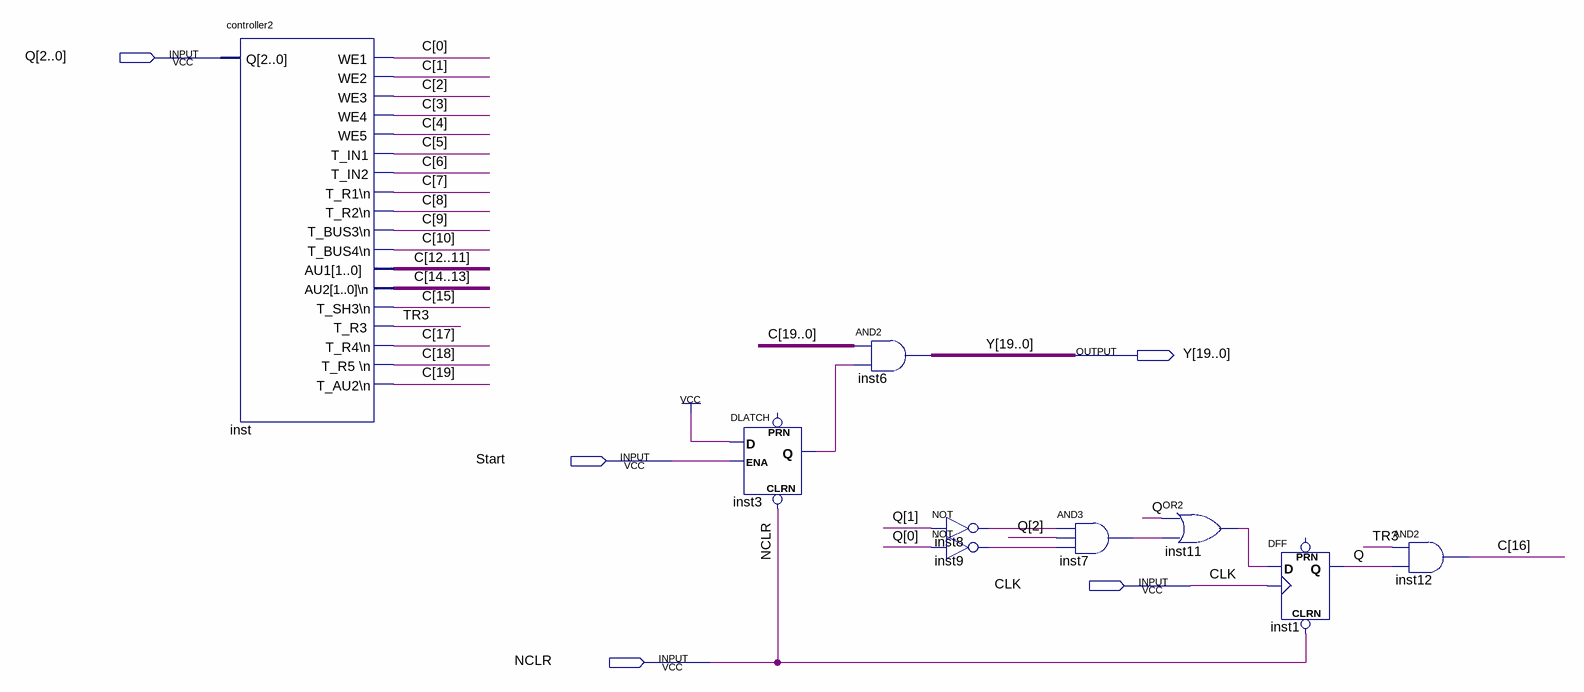
[diagram p0: schematic sheet]
// Quartus schematic OUTPUT_BLOCK.bdf as structural Verilog: 9 symbols, 5 pins
module OUTPUT_BLOCK (
  input  [2:0] Q,
  input  Start,
  input  CLK,
  input  NCLR,
  output [19:0] Y
);

  wire inst3_q, inst7_out, inst8_out, inst9_out, inst11_out, Q_1bit, TR3;
  wire [19:0] C;

  controller2 inst (
    .Q(Q), .WE1(C[0]), .WE2(C[1]), .WE3(C[2]), .WE4(C[3]), .WE5(C[4]), .T_IN1(C[5]), .T_IN2(C[6]),
    .\T_R1\n (C[7]), .\T_R2\n (C[8]), .\T_BUS3\n (C[9]), .\T_BUS4\n (C[10]), .AU1(C[12:11]),
    .\AU2[1..0]\n (C[14:13]), .\T_SH3\n (C[15]), .T_R3(TR3), .\T_R4\n (C[17]), .\T_R5_\n (C[18]),
    .\T_AU2\n (C[19]));
  DLATCH inst3 (.CLRN(NCLR), .D(1'b1), .ENA(Start), .Q(inst3_q));  // open: PRN
  assign Y = C & {20{inst3_q}};  // AND2 inst6, 20 bits wide
  not inst8 (inst8_out, Q[1]);
  not inst9 (inst9_out, Q[0]);
  and inst7 (inst7_out, inst8_out, Q[2], inst9_out);
  or inst11 (inst11_out, Q_1bit, inst7_out);
  DFF inst1 (.CLRN(NCLR), .CLK(CLK), .D(inst11_out), .Q(Q_1bit));  // open: PRN
  and inst12 (C[16], TR3, Q_1bit);
endmodule
